# EAGLE schematic schematic (EAGLE 9.6.2)
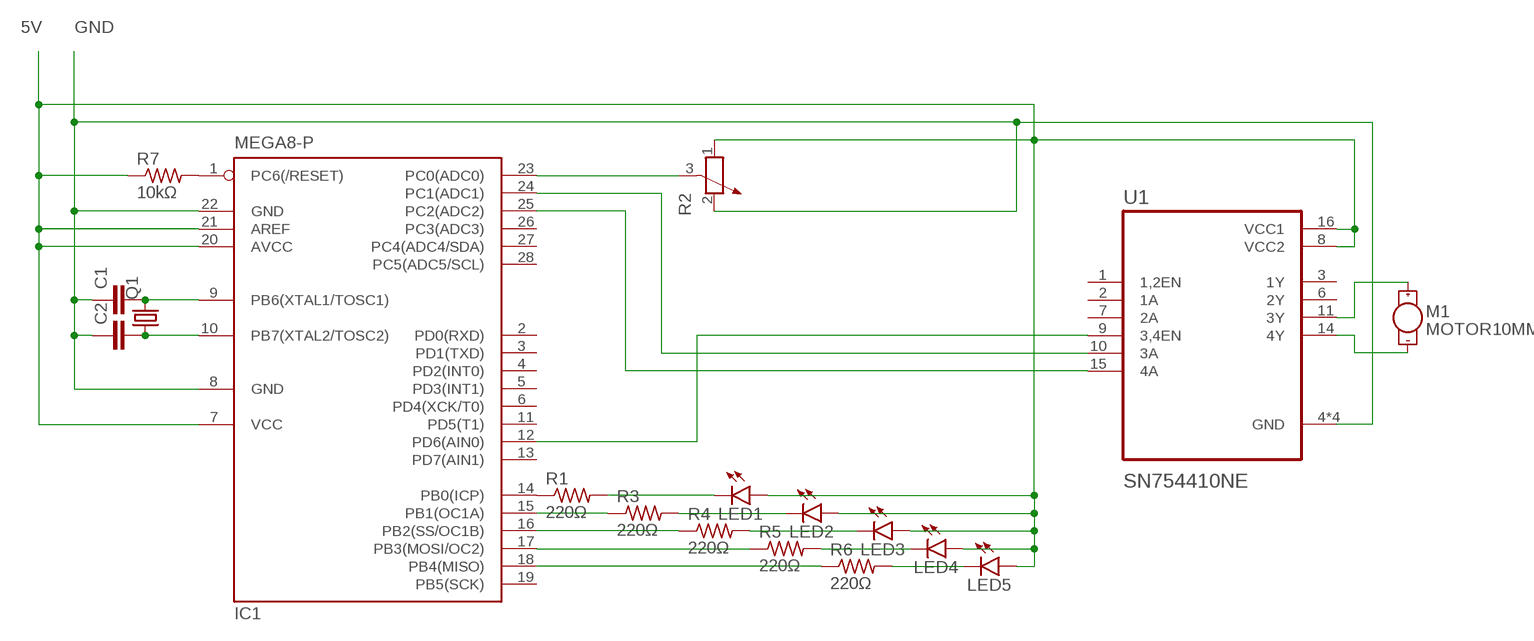
[diagram p0: schematic, sheet 1]

## Parts
C1  C2,5-3  [C2.5-3]
C2  C2,5-3  [C2.5-3]
IC1  MEGA8-P  [DIL28-3]
LED1  LED  [SMARTLED-TTW]
LED2  LED  [SMARTLED-TTW]
LED3  LED  [SMARTLED-TTW]
LED4  LED  [SMARTLED-TTW]
LED5  LED  [SMARTLED-TTW]
M1  MOTOR10MM  [VIBE-MOTOR-10MM]
Q1  CRYSTALHC18U-V  [HC18U-V]
R1  220Ω  R-US_0204/2V  [0204V]
R2  POTENTIOMETER_PT-10  [PT-10]
R3  220Ω  R-US_0204/2V  [0204V]
R4  220Ω  R-US_0204/2V  [0204V]
R5  220Ω  R-US_0204/2V  [0204V]
R6  220Ω  R-US_0204/2V  [0204V]
R7  10kΩ  R-US_0204/2V  [0204V]
U1  SN754410NE  [DIP762W45P254L1980H508Q16]

## Nets
5V: IC1.7(VCC) IC1.20(AVCC) IC1.21(AREF) LED1.A@1(A) LED2.A@1(A) LED3.A@1(A) LED4.A@1(A) LED5.A@1(A) R2.1 R7.1 U1.8(VCC2) U1.16(VCC1)
GND: C1.1 C2.1 IC1.8(GND) IC1.22(GND) R2.2 U1.4(GND) U1.5(GND) U1.12(GND) U1.13(GND)
N$1: LED1.C@1(C) R1.2
N$2: IC1.14(PB0(ICP)) R1.1
N$3: IC1.15(PB1(OC1A)) R3.1
N$4: IC1.16(PB2(SS/OC1B)) R4.1
N$5: IC1.17(PB3(MOSI/OC2)) R5.1
N$6: IC1.18(PB4(MISO)) R6.1
N$7: LED2.C@1(C) R3.2
N$8: LED3.C@1(C) R4.2
N$9: LED4.C@1(C) R5.2
N$10: LED5.C@1(C) R6.2
N$12: IC1.23(PC0(ADC0)) R2.3
N$14: IC1.1(PC6(/RESET)) R7.2
N$15: C1.2 IC1.9(PB6(XTAL1/TOSC1)) Q1.2
N$16: C2.2 IC1.10(PB7(XTAL2/TOSC2)) Q1.1
N$17: M1.+ U1.11(3Y)
N$18: IC1.12(PD6(AIN0)) U1.9(3,4EN)
N$19: IC1.25(PC2(ADC2)) U1.15(4A)
N$20: IC1.24(PC1(ADC1)) U1.10(3A)
N$21: M1.- U1.14(4Y)
Unconnected: IC1.2(PD0(RXD)) IC1.3(PD1(TXD)) IC1.4(PD2(INT0)) IC1.5(PD3(INT1)) IC1.6(PD4(XCK/T0)) IC1.11(PD5(T1)) IC1.13(PD7(AIN1)) IC1.19(PB5(SCK)) IC1.26(PC3(ADC3)) IC1.27(PC4(ADC4/SDA)) IC1.28(PC5(ADC5/SCL)) U1.1(1,2EN) U1.2(1A) U1.3(1Y) U1.6(2Y) U1.7(2A)

## Library data of the parts
C1 C2 = capacitor-wima:C: CAPACITOR naming: grid - package width
IC1 = atmel:MEGA8-P: MICROCONTROLLER 8 Kbytes FLASH, 1 kbytes SRAM, 512 bytes EEPROM, USART, 4-channel 10 bit ADC, 2-channel 8 bit ADC Pin compatible with Atmega48, ATMega88, ATMega168 Source: avr.lbr; OC_FARNELL: unknown; OC_NEWARK: unknown
LED1-LED5 = led:LED: LED OSRAM: - CHIPLED LG R971, LG N971, LY N971, LG Q971, LY Q971, LO R971, LY R971 LH N974, LH R974 LS Q976, LO Q976, LY Q976 LO Q996 - Hyper CHIPLED LW Q18S LB Q993, LB Q99A, LB R99A - SideLED LS A670, LO A670, LY A670, LG A670, LP A670 LB A673, LV A673, LT A673, LW A673 LH A674 LY A675 LS A676, LA A676, LO A676, LY A676, LW A676 LS A679, LY A679, LG A679 - Hyper Micro SIDELED® LS Y876, LA Y876, LO Y876, LY Y876 LT Y87S - SmartLED LW L88C, LW L88S LB L89C, LB L89S, LG L890 LS L89K, LO L89K, LY L89K LS L896, LA L896, LO L896, LY L896 - TOPLED LS T670, LO T670, LY T670, LG T670, LP T670 LSG T670, LSP T670, LSY T670, LOP T670, LYG T670 LG T671, LOG T671, LSG T671 LB T673, LV T673, LT T673, LW T673 LH T674 LS T676, LA T676, LO T676, LY T676, LB T676, LH T676, LSB T676, LW T676 LB T67C, LV T67C, LT T67C, LS T67K, LO T67K, LY T67K, LW E67C LS E67B, LA E67B, LO E67B, LY E67B, LB E67C, LV E67C, LT E67C LW T67C LS T679, LY T679, LG T679 LS T770, LO T770, LY T770, LG T770, LP T770 LB T773, LV T773, LT T773, LW T773 LH T774 LS E675, LA E675, LY E675, LS T675 LS T776, LA T776, LO T776, LY T776, LB T776 LHGB T686 LT T68C, LB T68C - Hyper Mini TOPLED® LB M676 - Mini TOPLED Santana® LG M470 LS M47K, LO M47K, LY M47K Source: http://www.osram.convergy.de LUXEON: - LUMILED® LXK2-PW12-R00, LXK2-PW12-S00, LXK2-PW14-U00, LXK2-PW14-V00 LXK2-PM12-R00, LXK2-PM12-S00, LXK2-PM14-U00 LXK2-PE12-Q00, LXK2-PE12-R00, LXK2-PE12-S00, LXK2-PE14-T00, LXK2-PE14-U00 LXK2-PB12-K00, LXK2-PB12-L00, LXK2-PB12-M00, LXK2-PB14-N00, LXK2-PB14-P00, LXK2-PB14-Q00 LXK2-PR12-L00, LXK2-PR12-M00, LXK2-PR14-Q00, LXK2-PR14-R00 LXK2-PD12-Q00, LXK2-PD12-R00, LXK2-PD12-S00 LXK2-PH12-R00, LXK2-PH12-S00 LXK2-PL12-P00, LXK2-PL12-Q00, LXK2-PL12-R00 Source: www.luxeon.com KINGBRIGHT: KA-3528ASYC Source: www.kingbright.com
M1 = SparkFun-Electromechanical:MOTOR: Motor (Single-Phase) Two-terminal, single-phase motors. SparkFun Products Vibration Motor <https://www.sparkfun.com/products/8449> (ROB-08449) Physical dimension and wire connections for this powerful vibration motor. Motor has a self adhesive backing.; PROD_ID: COMP-08572; SF_SKU: ROB-08449
Q1 = crystal:CRYSTAL: CRYSTAL; OC_FARNELL: unknown; OC_NEWARK: unknown
R1 R3-R7 = rcl:R-US_: RESISTOR, American symbol; SPICEPREFIX: R
R2 = rcl:POTENTIOMETER_: Potentiometer; SPICEMODEL: POT; SPICEPREFIX: X
U1 = SN754410NE:SN754410NE: Check availability <https://pricing.snapeda.com/parts/SN754410NE/Texas%20Instruments/view-part?ref=eda>; AVAILABILITY: In Stock; DESCRIPTION: Quadruple Half-H Drivers 16-PDIP -40 to 85; MF: Texas Instruments; MP: SN754410NE; PACKAGE: PDIP-16 Texas Instruments; PRICE: None; PURCHASE-URL: https://pricing.snapeda.com/search/part/SN754410NE/?ref=eda